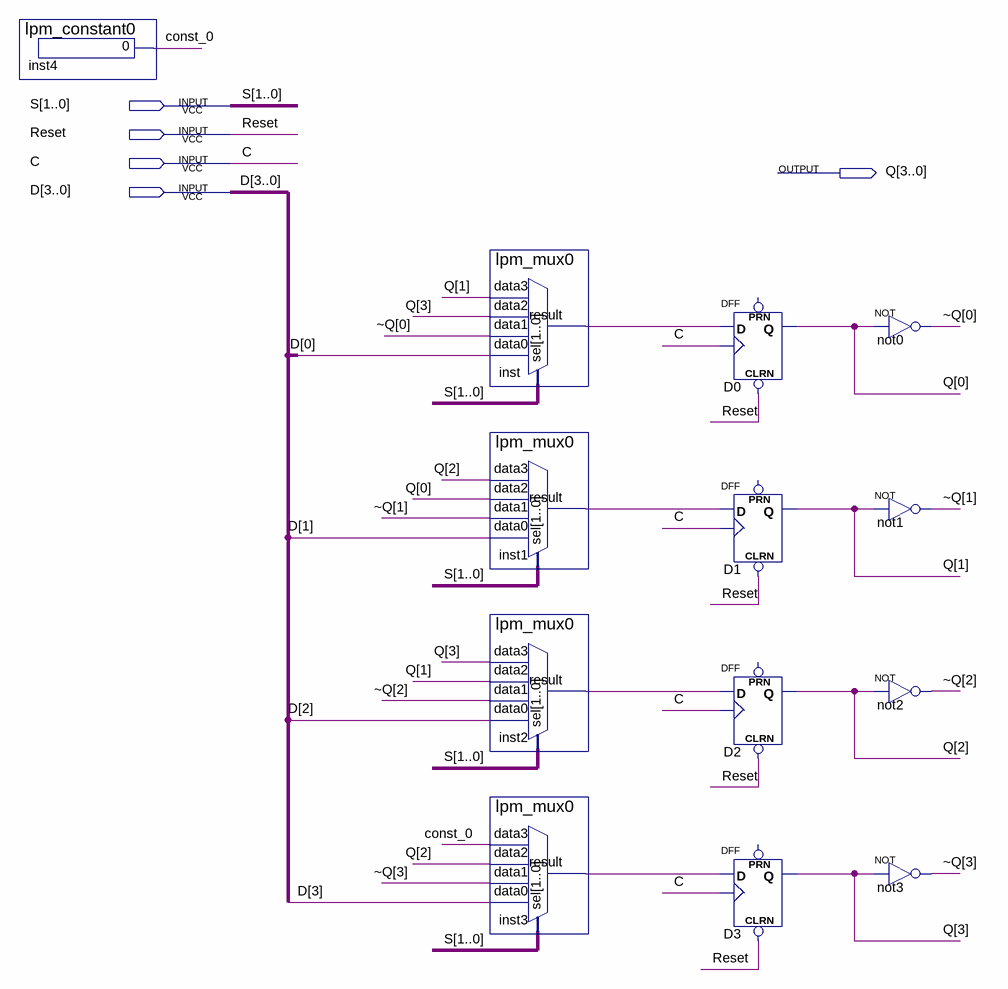
[diagram p0: schematic sheet]
// Quartus schematic Lab5_2.bdf as structural Verilog: 13 symbols, 5 pins
module Lab5_2 (
  input  [1:0] S,
  input  Reset,
  input  C,
  input  [3:0] D,
  output [3:0] Q
);

  wire const_0, inst1_result, inst2_result, inst3_result, inst_result;
  wire [3:0] \~Q ;

  lpm_constant0 inst4 (.result(const_0));
  lpm_mux0 inst (.data3(Q[1]), .data2(Q[3]), .data1(\~Q [0]), .data0(D[0]), .sel(S), .result(inst_result));
  lpm_mux0 inst1 (.data3(Q[2]), .data2(Q[0]), .data1(\~Q [1]), .data0(D[1]), .sel(S), .result(inst1_result));
  lpm_mux0 inst2 (.data3(Q[3]), .data2(Q[1]), .data1(\~Q [2]), .data0(D[2]), .sel(S), .result(inst2_result));
  lpm_mux0 inst3 (.data3(const_0), .data2(Q[2]), .data1(\~Q [3]), .data0(D[3]), .sel(S), .result(inst3_result));
  DFF D0 (.CLRN(Reset), .CLK(C), .D(inst_result), .Q(Q[0]));  // open: PRN
  DFF D1 (.CLRN(Reset), .CLK(C), .D(inst1_result), .Q(Q[1]));  // open: PRN
  DFF D2 (.CLRN(Reset), .CLK(C), .D(inst2_result), .Q(Q[2]));  // open: PRN
  DFF D3 (.CLRN(Reset), .CLK(C), .D(inst3_result), .Q(Q[3]));  // open: PRN
  not not0 (\~Q [0], Q[0]);
  not not1 (\~Q [1], Q[1]);
  not not2 (\~Q [2], Q[2]);
  not not3 (\~Q [3], Q[3]);
endmodule
